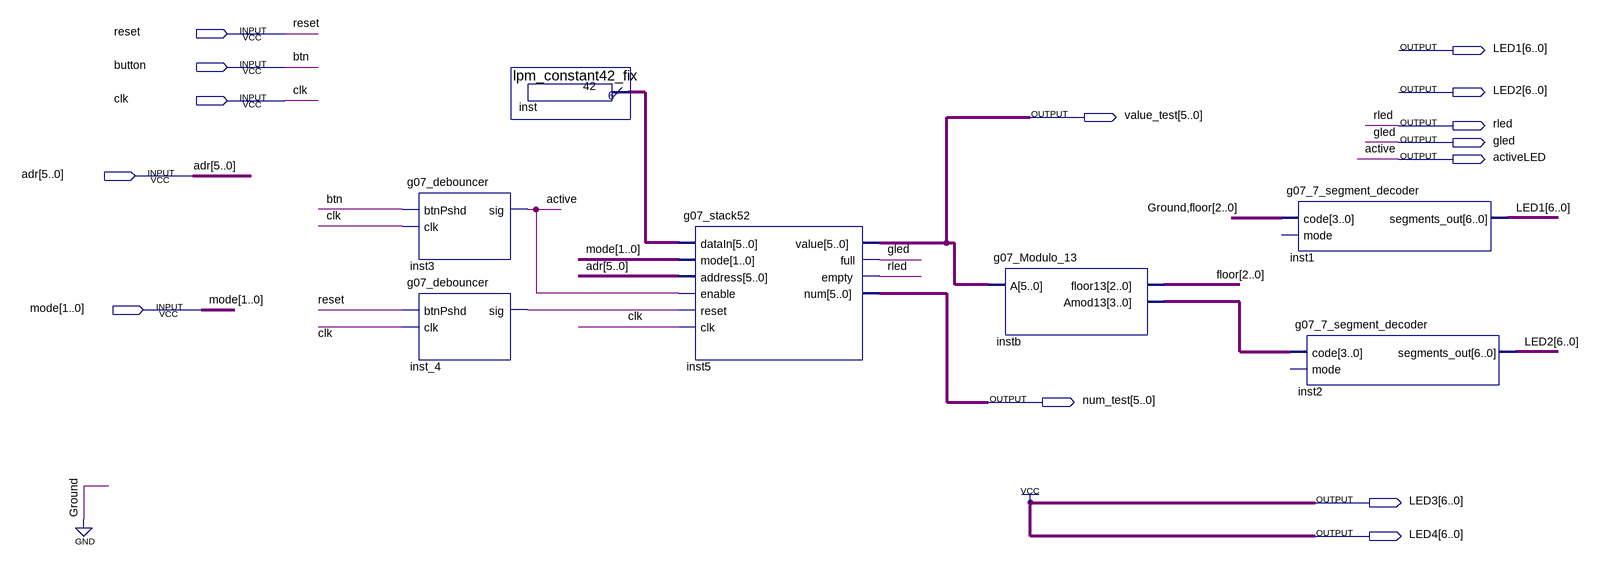
[diagram p0: schematic sheet]
// Quartus schematic g07_lab3_testbed.bdf as structural Verilog: 7 symbols, 14 pins
module g07_lab3_testbed (
  input  reset,
  input  button,
  input  clk,
  input  [5:0] adr,
  input  [1:0] mode,
  output [6:0] LED1,
  output [6:0] LED2,
  output [5:0] value_test,
  output rled,
  output gled,
  output activeLED,
  output [5:0] num_test,
  output [6:0] LED3,
  output [6:0] LED4
);

  wire inst_4_sig;
  wire [2:0] floor;
  wire [3:0] instb_amod13;
  wire [5:0] inst_result;

  g07_debouncer inst3 (.btnPshd(button), .clk(clk), .sig(activeLED));
  g07_debouncer inst_4 (.btnPshd(reset), .clk(clk), .sig(inst_4_sig));
  lpm_constant42_fix inst (.result(inst_result));
  g07_stack52 inst5 (
    .dataIn(inst_result), .mode(mode), .address(adr), .enable(activeLED), .reset(inst_4_sig), .clk(clk),
    .value(value_test), .full(gled), .empty(rled), .num(num_test));
  g07_Modulo_13 instb (.A(value_test), .floor13(floor), .Amod13(instb_amod13));
  g07_7_segment_decoder inst1 (.code({1'b0, floor}), .segments_out(LED1));  // open: mode
  g07_7_segment_decoder inst2 (.code(instb_amod13), .segments_out(LED2));  // open: mode

  assign LED3 = {7{1'b1}};
  assign LED4 = {7{1'b1}};

  // Other names for the same wires on the sheet: active = activeLED; btn = button
endmodule
